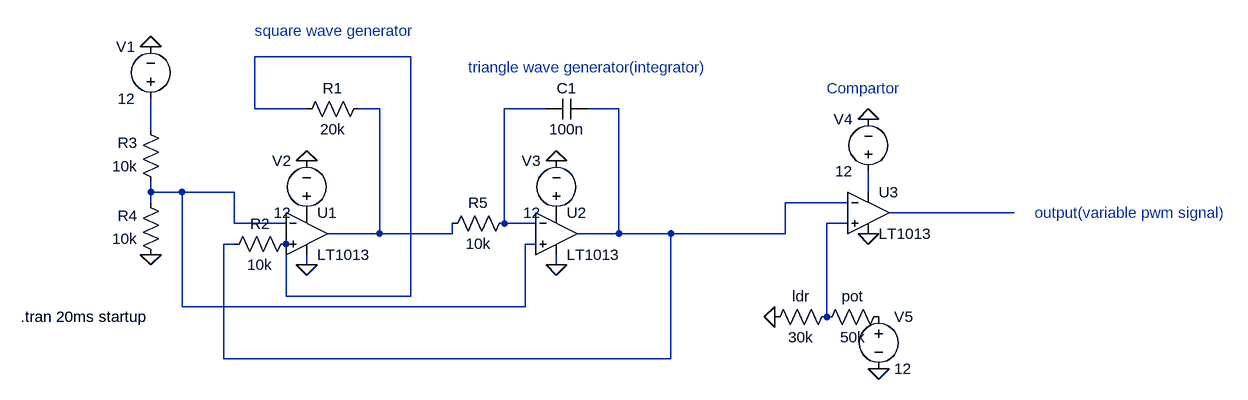
[diagram p0: schematic opamp_pwm_led_simulation.asc]
opamp_pwm_led_simulation.asc, the LTspice schematic file:
Version 4.1
SHEET 1 1536 680
WIRE 240 -96 0 -96
WIRE 0 -16 0 -96
WIRE 80 -16 0 -16
WIRE 192 -16 160 -16
WIRE 448 -16 384 -16
WIRE 560 -16 512 -16
WIRE -160 16 -160 -32
WIRE -160 112 -160 96
WIRE -112 112 -160 112
WIRE -32 112 -112 112
WIRE 944 112 944 80
WIRE -160 128 -160 112
WIRE 912 128 816 128
WIRE 1168 144 976 144
WIRE -32 160 -32 112
WIRE 48 160 -32 160
WIRE 384 160 384 -16
WIRE 432 160 384 160
WIRE 912 160 880 160
WIRE 192 176 192 -16
WIRE 192 176 112 176
WIRE 304 176 304 160
WIRE 304 176 192 176
WIRE 560 176 560 -16
WIRE 560 176 496 176
WIRE 640 176 560 176
WIRE 816 176 816 128
WIRE 816 176 640 176
WIRE -32 192 -48 192
WIRE 432 192 416 192
WIRE 80 224 80 208
WIRE 464 224 464 208
WIRE 48 272 48 192
WIRE 240 272 240 -96
WIRE 240 272 48 272
WIRE -112 288 -112 112
WIRE 416 288 416 192
WIRE 416 288 -112 288
WIRE 880 304 880 160
WIRE -48 368 -48 192
WIRE 640 368 640 176
WIRE 640 368 -48 368
FLAG -160 208 0
FLAG 80 224 0
FLAG 464 224 0
FLAG 80 64 0
FLAG 464 64 0
FLAG -160 -112 0
FLAG 944 0 0
FLAG 944 176 0
FLAG 800 304 0
FLAG 960 384 0
SYMBOL res 64 176 R90
WINDOW 0 0 56 VBottom 2
WINDOW 3 32 56 VTop 2
SYMATTR InstName R2
SYMATTR Value 10k
SYMBOL res -144 112 R180
WINDOW 0 36 76 Left 2
WINDOW 3 36 40 Left 2
SYMATTR InstName R3
SYMATTR Value 10k
SYMBOL res -144 224 R180
WINDOW 0 36 76 Left 2
WINDOW 3 36 40 Left 2
SYMATTR InstName R4
SYMATTR Value 10k
SYMBOL res 400 144 R90
WINDOW 0 0 56 VBottom 2
WINDOW 3 32 56 VTop 2
SYMATTR InstName R5
SYMATTR Value 10k
SYMBOL res 176 -32 R90
WINDOW 0 0 56 VBottom 2
WINDOW 3 32 56 VTop 2
SYMATTR InstName R1
SYMATTR Value 20k
SYMBOL cap 512 -32 R90
WINDOW 0 0 32 VBottom 2
WINDOW 3 32 32 VTop 2
SYMATTR InstName C1
SYMATTR Value 100n
SYMBOL voltage -160 -16 R180
WINDOW 0 24 96 Left 2
WINDOW 3 24 16 Left 2
WINDOW 123 0 0 Left 0
WINDOW 39 0 0 Left 0
SYMATTR InstName V1
SYMATTR Value 12
SYMBOL voltage 80 160 R180
WINDOW 0 24 96 Left 2
WINDOW 3 24 16 Left 2
WINDOW 123 0 0 Left 0
WINDOW 39 0 0 Left 0
SYMATTR InstName V2
SYMATTR Value 12
SYMBOL voltage 464 160 R180
WINDOW 0 24 96 Left 2
WINDOW 3 24 16 Left 2
WINDOW 123 0 0 Left 0
WINDOW 39 0 0 Left 0
SYMATTR InstName V3
SYMATTR Value 12
SYMBOL OpAmps\\LT1013 80 112 R0
SYMATTR InstName U1
SYMBOL OpAmps\\LT1013 464 112 R0
SYMATTR InstName U2
SYMBOL OpAmps\\LT1013 944 80 R0
SYMATTR InstName U3
SYMBOL voltage 944 96 R180
WINDOW 0 24 96 Left 2
WINDOW 3 24 16 Left 2
WINDOW 123 0 0 Left 0
WINDOW 39 0 0 Left 0
SYMATTR InstName V4
SYMATTR Value 12
SYMBOL res 896 288 R90
WINDOW 0 0 56 VBottom 2
WINDOW 3 32 56 VTop 2
SYMATTR InstName ldr
SYMATTR Value 30k
SYMBOL res 976 288 R90
WINDOW 0 0 56 VBottom 2
WINDOW 3 32 56 VTop 2
SYMATTR InstName pot
SYMATTR Value 50k
SYMBOL voltage 960 288 R0
WINDOW 123 0 0 Left 0
WINDOW 39 0 0 Left 0
SYMATTR InstName V5
SYMATTR Value 12
TEXT -360 304 Left 2 !.tran 20ms startup
TEXT 0 -136 Left 2 ;square wave generator
TEXT 328 -80 Left 2 ;triangle wave generator(integrator)
TEXT 880 -48 Left 2 ;Compartor
TEXT 1200 144 Left 2 ;output(variable pwm signal)

The netlist it stands for:
* opamp_pwm_led_simulation.asc
R2 N001 N004 10k
R3 N006 N005 10k
R4 0 N006 10k
R5 N003 N002 10k
R1 N002 N001 20k
C1 N004 N003 100n
V1 N005 0 12
V2 P001 0 12
V3 P002 0 12
X§U1 N001 N006 P001 0 N002 LT1013  ; pins In+ In- V+ V- OUT
X§U2 N006 N003 P002 0 N004 LT1013  ; pins In+ In- V+ V- OUT
X§U3 N009 N004 N007 0 N008 LT1013  ; pins In+ In- V+ V- OUT
V4 N007 0 12
R§ldr N009 0 30k
R§pot P003 N009 50k
V5 P003 0 12
.tran 20ms startup
* square wave generator
* triangle wave generator(integrator)
* Compartor
* output(variable pwm signal)
.lib LTC.lib
.backanno
.end